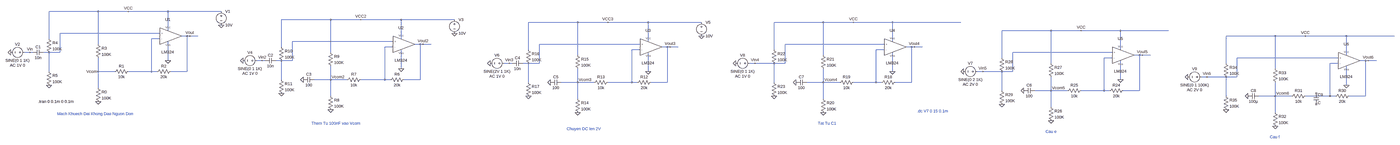
[diagram p0: schematic BAI 2 THUC HANH 1.asc, whole sheet]
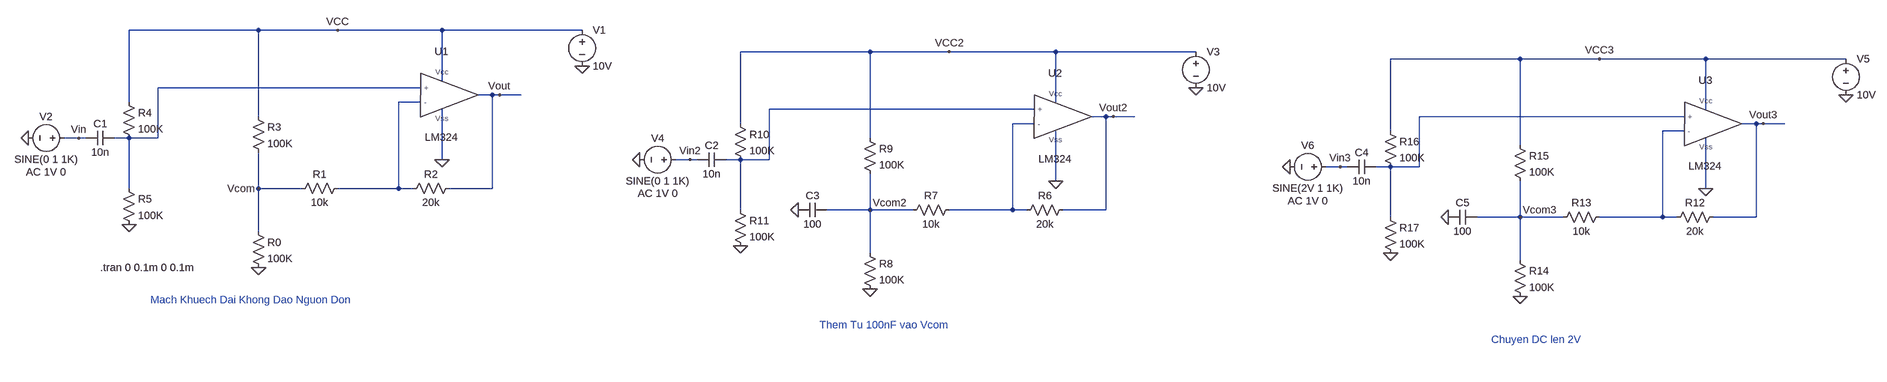
[diagram p1: schematic BAI 2 THUC HANH 1.asc, part, row 1 of 1, column 1 of 2]
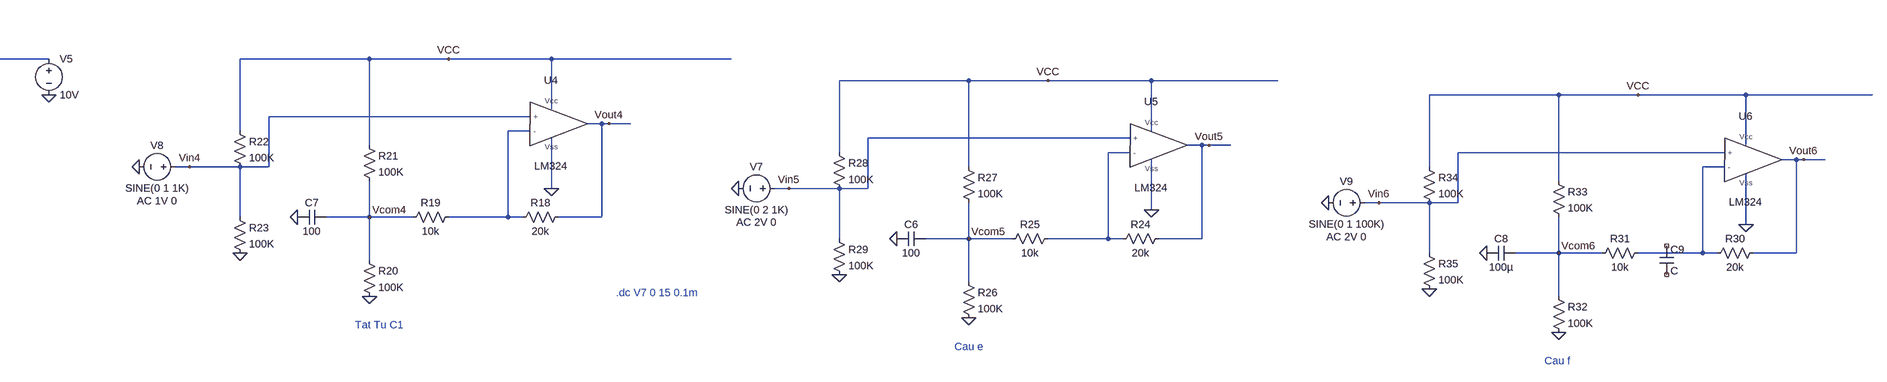
[diagram p2: schematic BAI 2 THUC HANH 1.asc, part, row 1 of 1, column 2 of 2]
BAI 2 THUC HANH 1.asc, the LTspice schematic file:
Version 4.1
SHEET 1 8260 752
WIRE -144 0 -432 0
WIRE 32 0 -144 0
WIRE 272 0 32 0
WIRE 672 0 272 0
WIRE 1312 48 1024 48
WIRE 1488 48 1312 48
WIRE 1728 48 1488 48
WIRE 2128 48 1728 48
WIRE 3104 64 2816 64
WIRE 3280 64 3104 64
WIRE 3520 64 3280 64
WIRE 3920 64 3520 64
WIRE 4656 64 4368 64
WIRE 4832 64 4656 64
WIRE 5072 64 4832 64
WIRE 5472 64 5072 64
WIRE 272 112 272 0
WIRE 6000 112 5712 112
WIRE 6176 112 6000 112
WIRE 6416 112 6176 112
WIRE 6816 112 6416 112
WIRE 224 128 -368 128
WIRE 384 144 352 144
WIRE 400 144 384 144
WIRE 448 144 400 144
WIRE 7440 144 7152 144
WIRE 7616 144 7440 144
WIRE 7856 144 7616 144
WIRE 8256 144 7856 144
WIRE -432 160 -432 0
WIRE 224 160 176 160
WIRE 1728 160 1728 48
WIRE 1680 176 1088 176
WIRE 3520 176 3520 64
WIRE 5072 176 5072 64
WIRE -144 192 -144 0
WIRE 1840 192 1808 192
WIRE 1856 192 1840 192
WIRE 1904 192 1856 192
WIRE 3472 192 2880 192
WIRE 5024 192 4432 192
WIRE 1024 208 1024 48
WIRE 1680 208 1632 208
WIRE 3632 208 3600 208
WIRE 3648 208 3632 208
WIRE 3696 208 3648 208
WIRE 5184 208 5152 208
WIRE 5200 208 5184 208
WIRE 5248 208 5200 208
WIRE 2816 224 2816 64
WIRE 3472 224 3424 224
WIRE 4368 224 4368 64
WIRE 5024 224 4976 224
WIRE 6416 224 6416 112
WIRE -544 240 -576 240
WIRE -528 240 -544 240
WIRE -432 240 -464 240
WIRE -368 240 -368 128
WIRE -368 240 -432 240
WIRE 1312 240 1312 48
WIRE 6368 240 5776 240
WIRE 3104 256 3104 64
WIRE 4656 256 4656 64
WIRE 6528 256 6496 256
WIRE 6544 256 6528 256
WIRE 6592 256 6544 256
WIRE 7856 256 7856 144
WIRE 5712 272 5712 112
WIRE 6368 272 6320 272
WIRE 7808 272 7216 272
WIRE 272 288 272 176
WIRE 912 288 880 288
WIRE 928 288 912 288
WIRE 1024 288 992 288
WIRE 1088 288 1088 176
WIRE 1088 288 1024 288
WIRE 7968 288 7936 288
WIRE 7984 288 7968 288
WIRE 8032 288 7984 288
WIRE 2704 304 2672 304
WIRE 2720 304 2704 304
WIRE 2816 304 2784 304
WIRE 2880 304 2880 192
WIRE 2880 304 2816 304
WIRE 4256 304 4224 304
WIRE 4368 304 4256 304
WIRE 4432 304 4432 192
WIRE 4432 304 4368 304
WIRE 6000 304 6000 112
WIRE 7152 304 7152 144
WIRE 7808 304 7760 304
WIRE 1728 336 1728 224
WIRE 7440 336 7440 144
WIRE -432 352 -432 240
WIRE -144 352 -144 272
WIRE -48 352 -144 352
WIRE 176 352 176 160
WIRE 176 352 32 352
WIRE 208 352 176 352
WIRE 384 352 384 144
WIRE 384 352 288 352
WIRE 3520 352 3520 240
WIRE 5072 352 5072 240
WIRE 5600 352 5568 352
WIRE 5712 352 5600 352
WIRE 5776 352 5776 240
WIRE 5776 352 5712 352
WIRE 7040 384 7008 384
WIRE 7152 384 7040 384
WIRE 7216 384 7216 272
WIRE 7216 384 7152 384
WIRE 1024 400 1024 288
WIRE 1312 400 1312 320
WIRE 1312 400 1216 400
WIRE 1408 400 1312 400
WIRE 1632 400 1632 208
WIRE 1632 400 1488 400
WIRE 1664 400 1632 400
WIRE 1840 400 1840 192
WIRE 1840 400 1744 400
WIRE 6416 400 6416 288
WIRE 2816 416 2816 304
WIRE 3104 416 3104 336
WIRE 3104 416 3008 416
WIRE 3200 416 3104 416
WIRE 3424 416 3424 224
WIRE 3424 416 3280 416
WIRE 3456 416 3424 416
WIRE 3632 416 3632 208
WIRE 3632 416 3536 416
WIRE 4368 416 4368 304
WIRE 4656 416 4656 336
WIRE 4656 416 4560 416
WIRE 4752 416 4656 416
WIRE 4976 416 4976 224
WIRE 4976 416 4832 416
WIRE 5008 416 4976 416
WIRE 5184 416 5184 208
WIRE 5184 416 5088 416
WIRE 7856 432 7856 320
WIRE -144 448 -144 352
WIRE 5712 464 5712 352
WIRE 6000 464 6000 384
WIRE 6000 464 5904 464
WIRE 6096 464 6000 464
WIRE 6320 464 6320 272
WIRE 6320 464 6176 464
WIRE 6352 464 6320 464
WIRE 6528 464 6528 256
WIRE 6528 464 6432 464
WIRE 1312 496 1312 400
WIRE 7152 496 7152 384
WIRE 7440 496 7440 416
WIRE 7440 496 7344 496
WIRE 7536 496 7440 496
WIRE 7760 496 7760 304
WIRE 7760 496 7616 496
WIRE 7792 496 7760 496
WIRE 7968 496 7968 288
WIRE 7968 496 7872 496
WIRE 3104 512 3104 416
WIRE 4656 512 4656 416
WIRE 6000 560 6000 464
WIRE 7440 592 7440 496
FLAG 400 144 Vout
FLAG 272 288 0
FLAG -144 528 0
FLAG 32 0 VCC
FLAG -544 240 Vin
FLAG -432 432 0
FLAG 672 80 0
FLAG -656 240 0
FLAG -144 352 Vcom
FLAG 1856 192 Vout2
FLAG 1728 336 0
FLAG 1312 576 0
FLAG 1488 48 VCC2
FLAG 912 288 Vin2
FLAG 1024 480 0
FLAG 2128 128 0
FLAG 800 288 0
FLAG 1312 400 Vcom2
FLAG 1152 400 0
FLAG 3648 208 Vout3
FLAG 3520 352 0
FLAG 3104 592 0
FLAG 3280 64 VCC3
FLAG 2704 304 Vin3
FLAG 2816 496 0
FLAG 3920 144 0
FLAG 2592 304 0
FLAG 3104 416 Vcom3
FLAG 2944 416 0
FLAG 5200 208 Vout4
FLAG 5072 352 0
FLAG 4656 592 0
FLAG 4832 64 VCC
FLAG 4256 304 Vin4
FLAG 4368 496 0
FLAG 4144 304 0
FLAG 4656 416 Vcom4
FLAG 4496 416 0
FLAG 6544 256 Vout5
FLAG 6416 400 0
FLAG 6000 640 0
FLAG 6176 112 VCC
FLAG 5600 352 Vin5
FLAG 5712 544 0
FLAG 5488 352 0
FLAG 6000 464 Vcom5
FLAG 5840 464 0
FLAG 7984 288 Vout6
FLAG 7856 432 0
FLAG 7440 672 0
FLAG 7616 144 VCC
FLAG 7040 384 Vin6
FLAG 7152 576 0
FLAG 6928 384 0
FLAG 7440 496 Vcom6
FLAG 7280 496 0
SYMBOL LM324 272 144 R0
SYMATTR InstName U1
SYMBOL res 304 336 R90
WINDOW 0 0 56 VBottom 2
WINDOW 3 32 56 VTop 2
SYMATTR InstName R2
SYMATTR Value 20k
SYMBOL res 48 336 R90
WINDOW 0 0 56 VBottom 2
WINDOW 3 32 56 VTop 2
SYMATTR InstName R1
SYMATTR Value 10k
SYMBOL res -160 432 R0
SYMATTR InstName R0
SYMATTR Value 100K
SYMBOL res -160 176 R0
SYMATTR InstName R3
SYMATTR Value 100K
SYMBOL cap -464 224 R90
WINDOW 0 0 32 VBottom 2
WINDOW 3 32 32 VTop 2
SYMATTR InstName C1
SYMATTR Value 10n
SYMBOL res -448 144 R0
SYMATTR InstName R4
SYMATTR Value 100K
SYMBOL res -448 336 R0
SYMATTR InstName R5
SYMATTR Value 100K
SYMBOL voltage 672 -16 R0
SYMATTR InstName V1
SYMATTR Value 10V
SYMBOL voltage -560 240 R90
WINDOW 0 -32 56 VBottom 2
WINDOW 3 32 56 VTop 2
WINDOW 123 60 56 VTop 2
WINDOW 39 0 0 Left 0
SYMATTR InstName V2
SYMATTR Value SINE(0 1 1K)
SYMATTR Value2 AC 1V 0
SYMBOL LM324 1728 192 R0
SYMATTR InstName U2
SYMBOL res 1760 384 R90
WINDOW 0 0 56 VBottom 2
WINDOW 3 32 56 VTop 2
SYMATTR InstName R6
SYMATTR Value 20k
SYMBOL res 1504 384 R90
WINDOW 0 0 56 VBottom 2
WINDOW 3 32 56 VTop 2
SYMATTR InstName R7
SYMATTR Value 10k
SYMBOL res 1296 480 R0
SYMATTR InstName R8
SYMATTR Value 100K
SYMBOL res 1296 224 R0
SYMATTR InstName R9
SYMATTR Value 100K
SYMBOL cap 992 272 R90
WINDOW 0 0 32 VBottom 2
WINDOW 3 32 32 VTop 2
SYMATTR InstName C2
SYMATTR Value 10n
SYMBOL res 1008 192 R0
SYMATTR InstName R10
SYMATTR Value 100K
SYMBOL res 1008 384 R0
SYMATTR InstName R11
SYMATTR Value 100K
SYMBOL voltage 2128 32 R0
SYMATTR InstName V3
SYMATTR Value 10V
SYMBOL voltage 896 288 R90
WINDOW 0 -32 56 VBottom 2
WINDOW 3 32 56 VTop 2
WINDOW 123 60 56 VTop 2
WINDOW 39 0 0 Left 0
SYMATTR InstName V4
SYMATTR Value SINE(0 1 1K)
SYMATTR Value2 AC 1V 0
SYMBOL cap 1216 384 R90
WINDOW 0 0 32 VBottom 2
WINDOW 3 32 32 VTop 2
SYMATTR InstName C3
SYMATTR Value 100
SYMBOL LM324 3520 208 R0
SYMATTR InstName U3
SYMBOL res 3552 400 R90
WINDOW 0 0 56 VBottom 2
WINDOW 3 32 56 VTop 2
SYMATTR InstName R12
SYMATTR Value 20k
SYMBOL res 3296 400 R90
WINDOW 0 0 56 VBottom 2
WINDOW 3 32 56 VTop 2
SYMATTR InstName R13
SYMATTR Value 10k
SYMBOL res 3088 496 R0
SYMATTR InstName R14
SYMATTR Value 100K
SYMBOL res 3088 240 R0
SYMATTR InstName R15
SYMATTR Value 100K
SYMBOL cap 2784 288 R90
WINDOW 0 0 32 VBottom 2
WINDOW 3 32 32 VTop 2
SYMATTR InstName C4
SYMATTR Value 10n
SYMBOL res 2800 208 R0
SYMATTR InstName R16
SYMATTR Value 100K
SYMBOL res 2800 400 R0
SYMATTR InstName R17
SYMATTR Value 100K
SYMBOL voltage 3920 48 R0
SYMATTR InstName V5
SYMATTR Value 10V
SYMBOL voltage 2688 304 R90
WINDOW 0 -32 56 VBottom 2
WINDOW 3 32 56 VTop 2
WINDOW 123 60 56 VTop 2
WINDOW 39 0 0 Left 0
SYMATTR InstName V6
SYMATTR Value SINE(2V 1 1K)
SYMATTR Value2 AC 1V 0
SYMBOL cap 3008 400 R90
WINDOW 0 0 32 VBottom 2
WINDOW 3 32 32 VTop 2
SYMATTR InstName C5
SYMATTR Value 100
SYMBOL LM324 5072 208 R0
SYMATTR InstName U4
SYMBOL res 5104 400 R90
WINDOW 0 0 56 VBottom 2
WINDOW 3 32 56 VTop 2
SYMATTR InstName R18
SYMATTR Value 20k
SYMBOL res 4848 400 R90
WINDOW 0 0 56 VBottom 2
WINDOW 3 32 56 VTop 2
SYMATTR InstName R19
SYMATTR Value 10k
SYMBOL res 4640 496 R0
SYMATTR InstName R20
SYMATTR Value 100K
SYMBOL res 4640 240 R0
SYMATTR InstName R21
SYMATTR Value 100K
SYMBOL res 4352 208 R0
SYMATTR InstName R22
SYMATTR Value 100K
SYMBOL res 4352 400 R0
SYMATTR InstName R23
SYMATTR Value 100K
SYMBOL voltage 4240 304 R90
WINDOW 0 -32 56 VBottom 2
WINDOW 3 32 56 VTop 2
WINDOW 123 60 56 VTop 2
WINDOW 39 0 0 Left 0
SYMATTR InstName V8
SYMATTR Value SINE(0 1 1K)
SYMATTR Value2 AC 1V 0
SYMBOL cap 4560 400 R90
WINDOW 0 0 32 VBottom 2
WINDOW 3 32 32 VTop 2
SYMATTR InstName C7
SYMATTR Value 100
SYMBOL LM324 6416 256 R0
SYMATTR InstName U5
SYMBOL res 6448 448 R90
WINDOW 0 0 56 VBottom 2
WINDOW 3 32 56 VTop 2
SYMATTR InstName R24
SYMATTR Value 20k
SYMBOL res 6192 448 R90
WINDOW 0 0 56 VBottom 2
WINDOW 3 32 56 VTop 2
SYMATTR InstName R25
SYMATTR Value 10k
SYMBOL res 5984 544 R0
SYMATTR InstName R26
SYMATTR Value 100K
SYMBOL res 5984 288 R0
SYMATTR InstName R27
SYMATTR Value 100K
SYMBOL res 5696 256 R0
SYMATTR InstName R28
SYMATTR Value 100K
SYMBOL res 5696 448 R0
SYMATTR InstName R29
SYMATTR Value 100K
SYMBOL voltage 5584 352 R90
WINDOW 0 -32 56 VBottom 2
WINDOW 3 32 56 VTop 2
WINDOW 123 60 56 VTop 2
WINDOW 39 0 0 Left 0
SYMATTR InstName V7
SYMATTR Value SINE(0 2 1K)
SYMATTR Value2 AC 2V 0
SYMBOL cap 5904 448 R90
WINDOW 0 0 32 VBottom 2
WINDOW 3 32 32 VTop 2
SYMATTR InstName C6
SYMATTR Value 100
SYMBOL LM324 7856 288 R0
SYMATTR InstName U6
SYMBOL res 7888 480 R90
WINDOW 0 0 56 VBottom 2
WINDOW 3 32 56 VTop 2
SYMATTR InstName R30
SYMATTR Value 20k
SYMBOL res 7632 480 R90
WINDOW 0 0 56 VBottom 2
WINDOW 3 32 56 VTop 2
SYMATTR InstName R31
SYMATTR Value 10k
SYMBOL res 7424 576 R0
SYMATTR InstName R32
SYMATTR Value 100K
SYMBOL res 7424 320 R0
SYMATTR InstName R33
SYMATTR Value 100K
SYMBOL res 7136 288 R0
SYMATTR InstName R34
SYMATTR Value 100K
SYMBOL res 7136 480 R0
SYMATTR InstName R35
SYMATTR Value 100K
SYMBOL voltage 7024 384 R90
WINDOW 0 -32 56 VBottom 2
WINDOW 3 32 56 VTop 2
WINDOW 123 60 56 VTop 2
WINDOW 39 0 0 Left 0
SYMATTR InstName V9
SYMATTR Value SINE(0 1 100K)
SYMATTR Value2 AC 2V 0
SYMBOL cap 7344 480 R90
WINDOW 0 0 32 VBottom 2
WINDOW 3 32 32 VTop 2
SYMATTR InstName C8
SYMATTR Value 100µ
SYMATTR Description Capacitor
SYMATTR Type cap
SYMATTR SpiceLine V=50 Irms=620m Rser=0.14 Lser=0 mfg="Nichicon" pn="UPL1H101MPH" type="Al electrolytic"
SYMBOL cap 7664 480 R0
SYMATTR InstName C9
TEXT -496 528 Left 2 !.tran 0 0.1m 0 0.1m
TEXT -384 600 Left 2 ;Mach Khuech Dai Khong Dao Nguon Don
TEXT 1200 656 Left 2 ;Them Tu 100nF vao Vcom
TEXT 3040 688 Left 2 ;Chuyen DC len 2V
TEXT 4624 656 Left 2 ;Tat Tu C1
TEXT 5968 704 Left 2 ;Cau e
TEXT 5216 584 Left 2 ;.dc V7 0 15 0.1m
TEXT 7408 736 Left 2 ;Cau f

The netlist it stands for:
* BAI 2 THUC HANH 1.asc
X§U1 N001 N002 VCC 0 Vout LM324  ; pins + - Vcc Vss ?
R2 Vout N002 20k
R1 N002 Vcom 10k
R0 Vcom 0 100K
R3 VCC Vcom 100K
C1 N001 Vin 10n
R4 VCC N001 100K
R5 N001 0 100K
V1 VCC 0 10V
V2 Vin 0 SINE(0 1 1K) AC 1V 0
X§U2 N003 N005 VCC2 0 Vout2 LM324  ; pins + - Vcc Vss ?
R6 Vout2 N005 20k
R7 N005 Vcom2 10k
R8 Vcom2 0 100K
R9 VCC2 Vcom2 100K
C2 N003 Vin2 10n
R10 VCC2 N003 100K
R11 N003 0 100K
V3 VCC2 0 10V
V4 Vin2 0 SINE(0 1 1K) AC 1V 0
C3 Vcom2 0 100
X§U3 N004 N006 VCC3 0 Vout3 LM324  ; pins + - Vcc Vss ?
R12 Vout3 N006 20k
R13 N006 Vcom3 10k
R14 Vcom3 0 100K
R15 VCC3 Vcom3 100K
C4 N004 Vin3 10n
R16 VCC3 N004 100K
R17 N004 0 100K
V5 VCC3 0 10V
V6 Vin3 0 SINE(2V 1 1K) AC 1V 0
C5 Vcom3 0 100
X§U4 Vin4 N007 VCC 0 Vout4 LM324  ; pins + - Vcc Vss ?
R18 Vout4 N007 20k
R19 N007 Vcom4 10k
R20 Vcom4 0 100K
R21 VCC Vcom4 100K
R22 VCC Vin4 100K
R23 Vin4 0 100K
V8 Vin4 0 SINE(0 1 1K) AC 1V 0
C7 Vcom4 0 100
X§U5 Vin5 N008 VCC 0 Vout5 LM324  ; pins + - Vcc Vss ?
R24 Vout5 N008 20k
R25 N008 Vcom5 10k
R26 Vcom5 0 100K
R27 VCC Vcom5 100K
R28 VCC Vin5 100K
R29 Vin5 0 100K
V7 Vin5 0 SINE(0 2 1K) AC 2V 0
C6 Vcom5 0 100
X§U6 Vin6 N009 VCC 0 Vout6 LM324  ; pins + - Vcc Vss ?
R30 Vout6 N009 20k
R31 N009 Vcom6 10k
R32 Vcom6 0 100K
R33 VCC Vcom6 100K
R34 VCC Vin6 100K
R35 Vin6 0 100K
V9 Vin6 0 SINE(0 1 100K) AC 2V 0
C8 Vcom6 0 100µ V=50 Irms=620m Rser=0.14 Lser=0 mfg="Nichicon" pn="UPL1H101MPH" type="Al electrolytic"
C9 NC_01 NC_02 C
.tran 0 0.1m 0 0.1m
* Mach Khuech Dai Khong Dao Nguon Don
* Them Tu 100nF vao Vcom
* Chuyen DC len 2V
* Tat Tu C1
* Cau e
* .dc V7 0 15 0.1m
* Cau f
.lib E:\ThiThucHanhCoHa\CoHa\LM324.cir
.backanno
.end